# EAGLE schematic time-module (EAGLE 7.7.0)
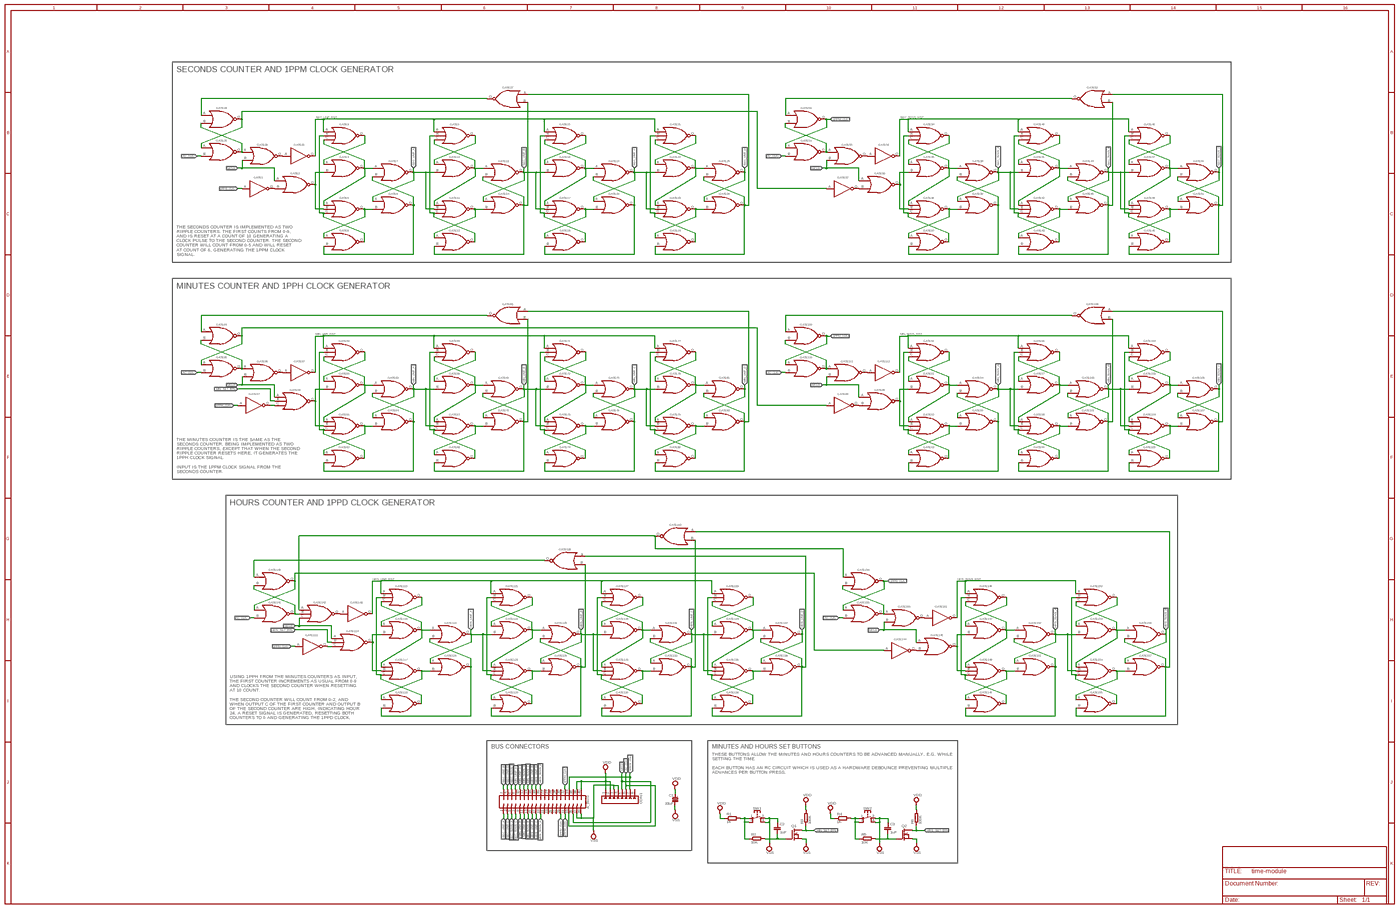
[diagram p0: schematic, sheet 1, overview]
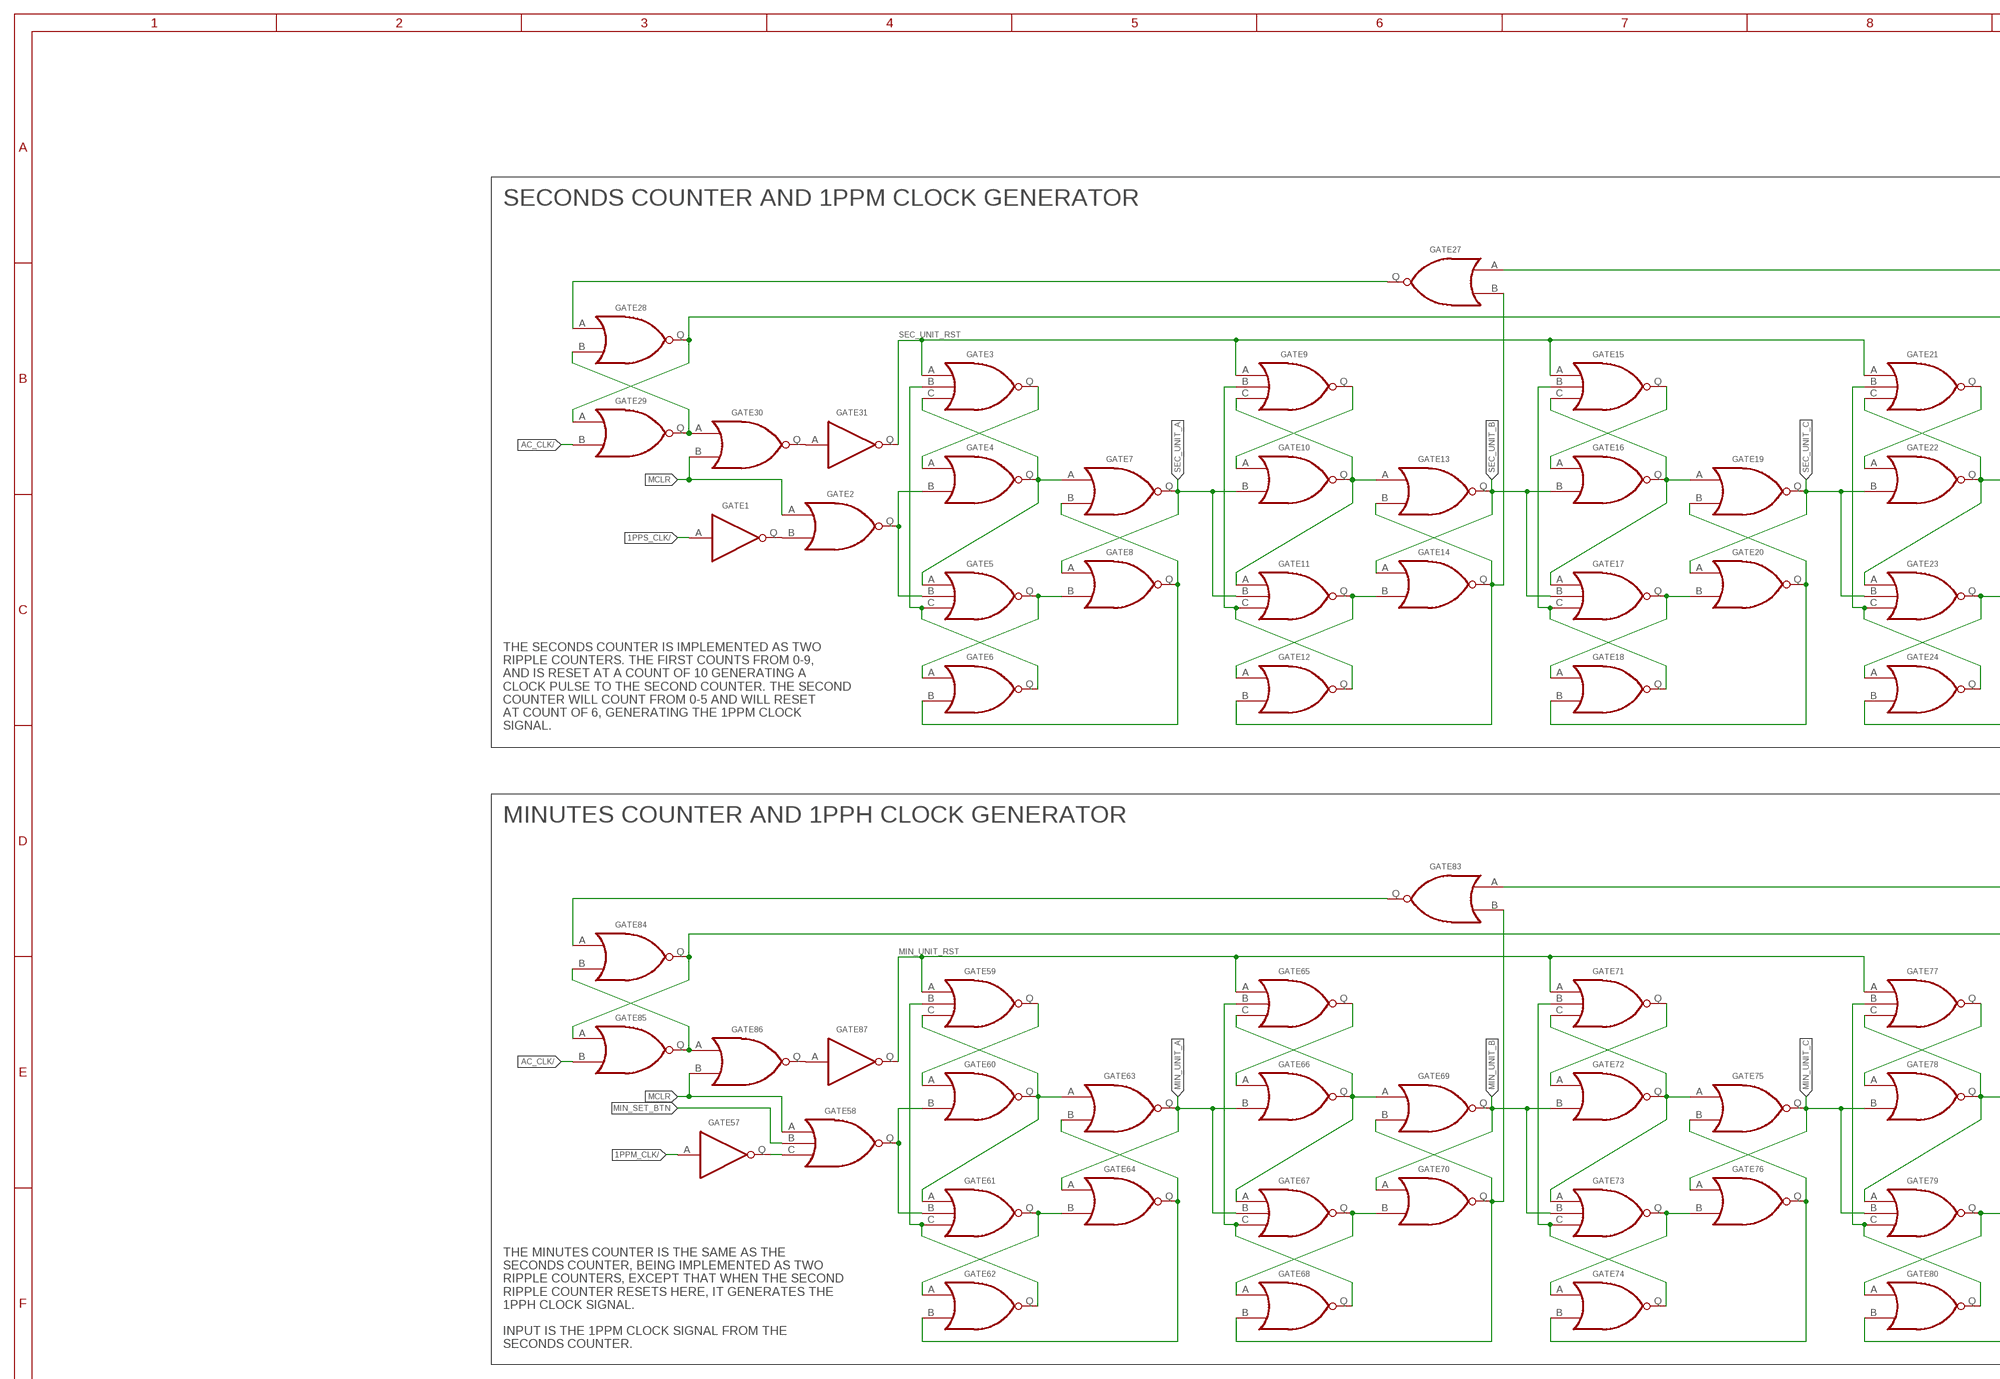
[diagram p1: schematic, sheet 1, part 1 of 4]
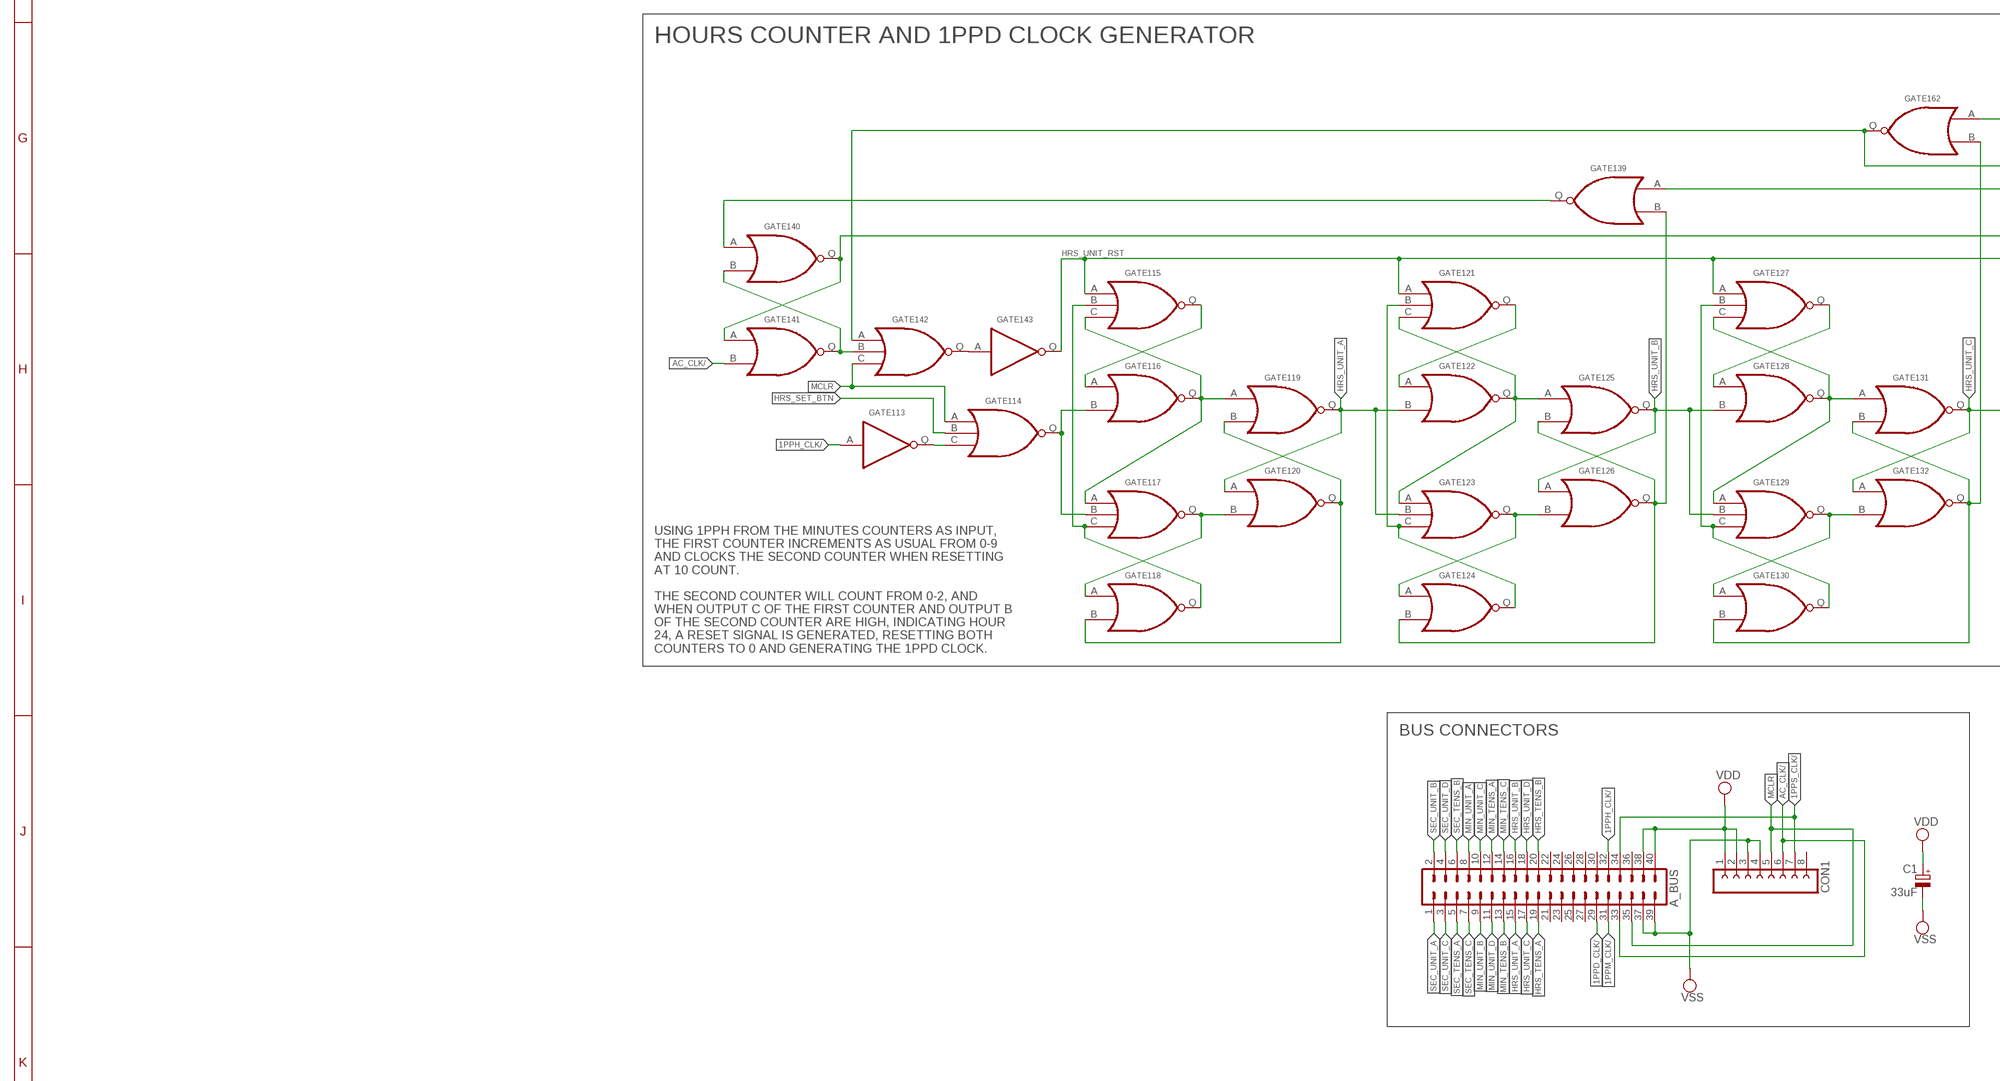
[diagram p2: schematic, sheet 1, part 2 of 4]
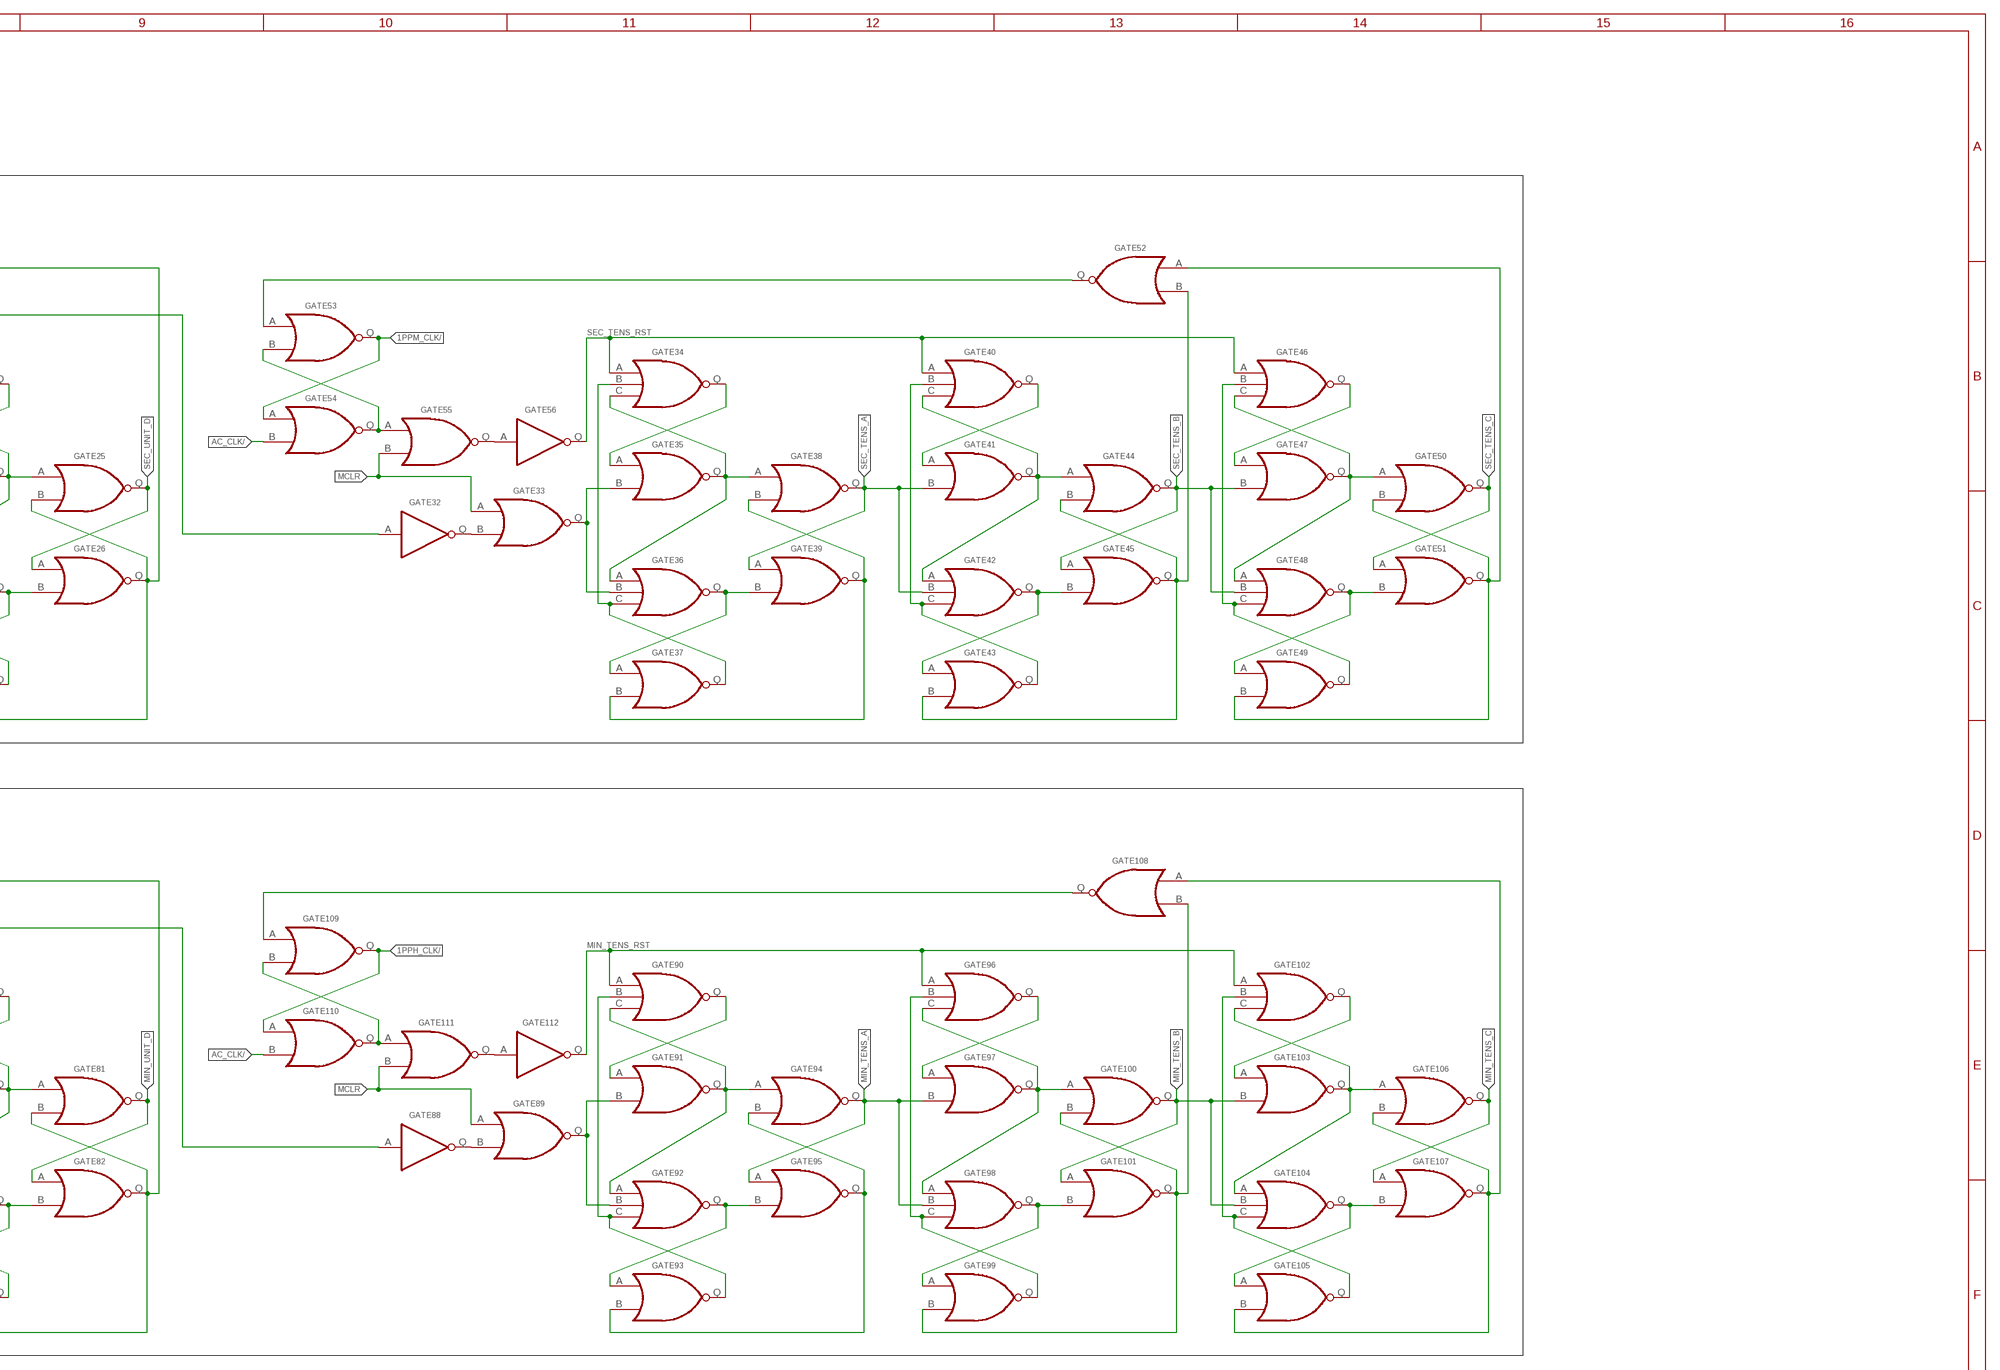
[diagram p3: schematic, sheet 1, part 3 of 4]
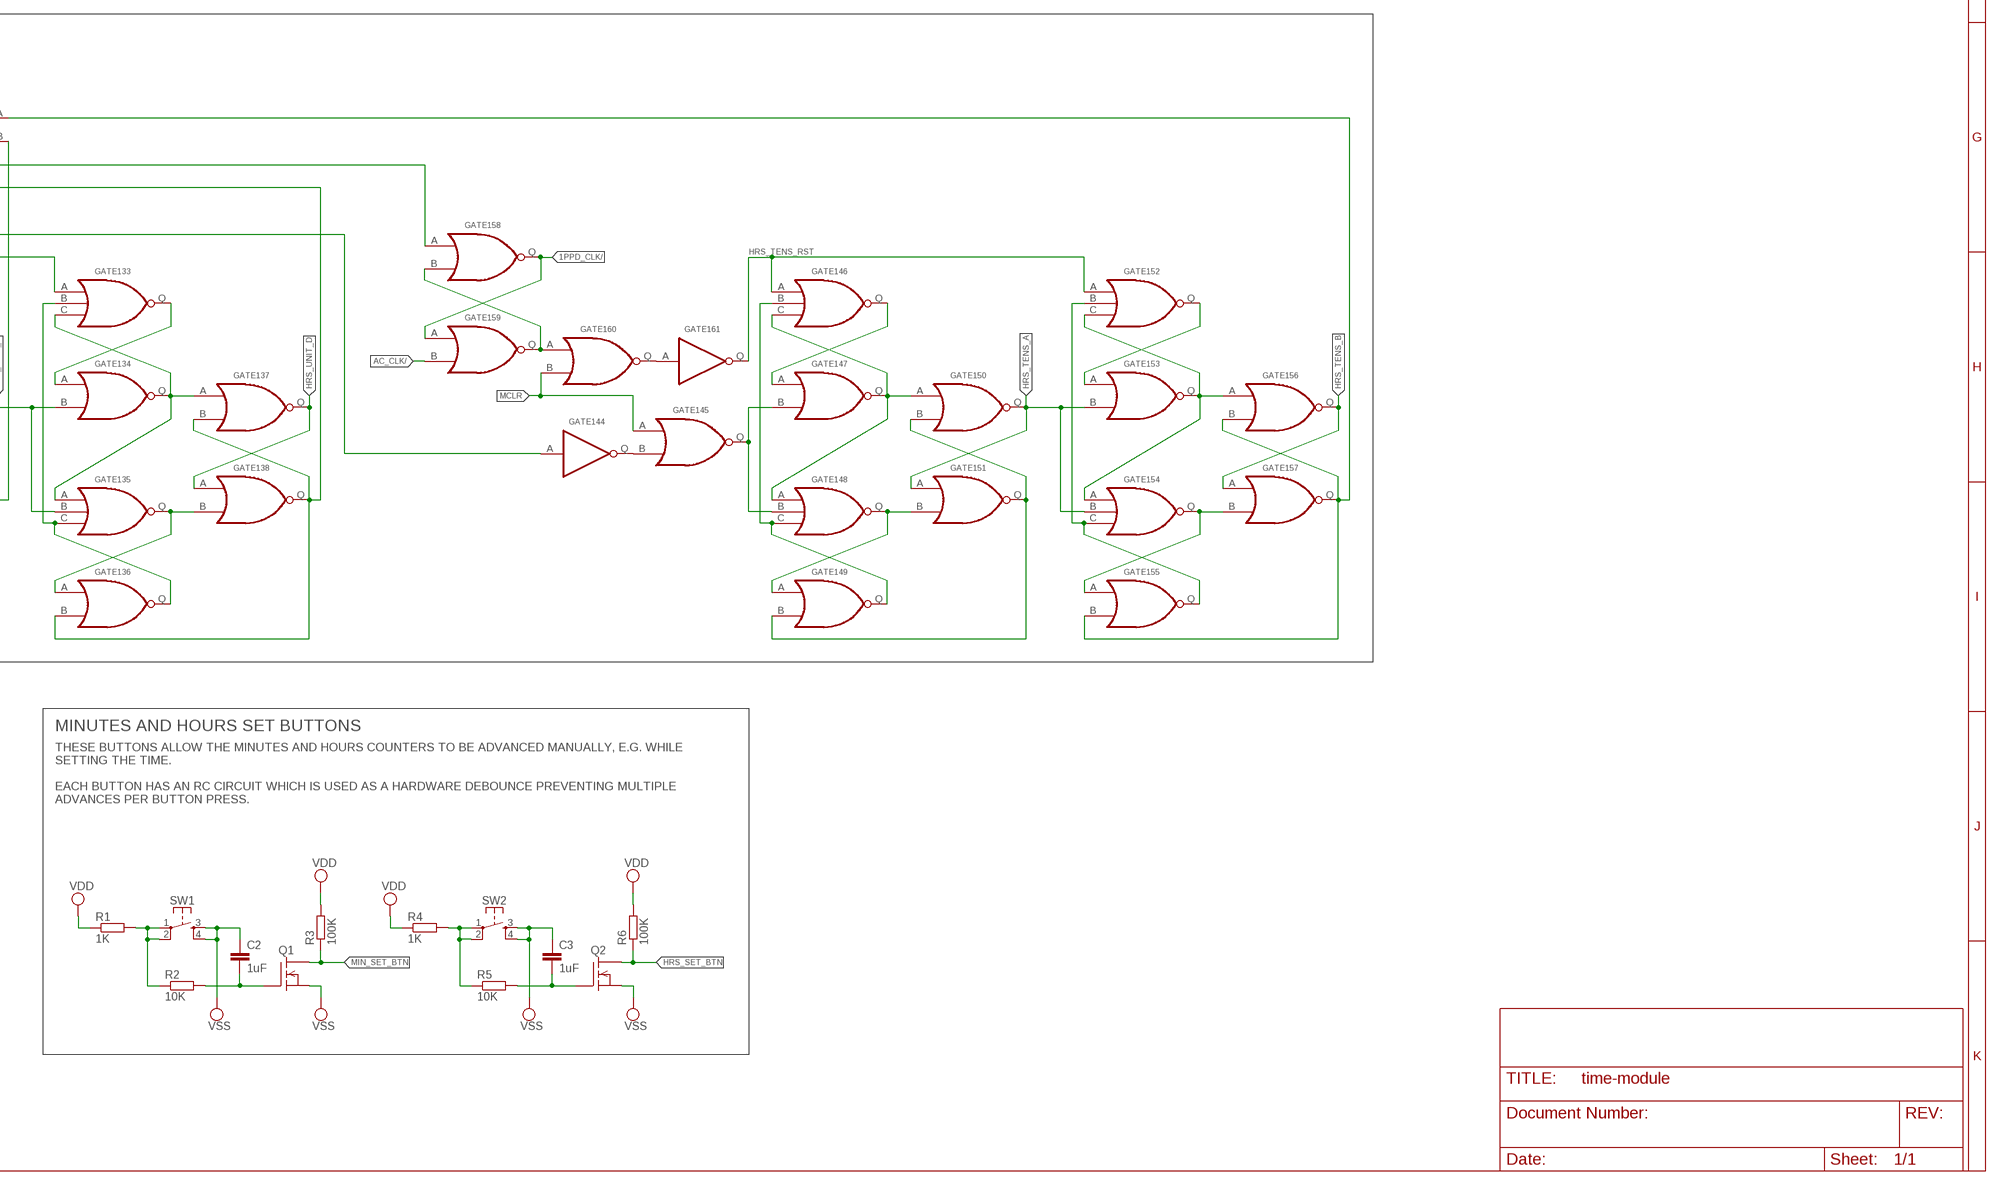
[diagram p4: schematic, sheet 1, part 4 of 4]

## Parts
A_BUS  MA20-2  [MA20-2]
C1  33uF  CPOL-EUE2.5-6  [E2,5-6]
C2  1uF  C-EU050-025X075  [C050-025X075]
C3  1uF  C-EU050-025X075  [C050-025X075]
CON1  FE08-1  [FE08]
GATE1  INVERTER  [INVERTER]
GATE2  2NOR  [2NOR]
GATE3  3NOR  [3NOR]
GATE4  2NOR  [2NOR]
GATE5  3NOR  [3NOR]
GATE6  2NOR  [2NOR]
GATE7  2NOR  [2NOR]
GATE8  2NOR  [2NOR]
GATE9  3NOR  [3NOR]
GATE10  2NOR  [2NOR]
GATE11  3NOR  [3NOR]
GATE12  2NOR  [2NOR]
GATE13  2NOR  [2NOR]
GATE14  2NOR  [2NOR]
GATE15  3NOR  [3NOR]
GATE16  2NOR  [2NOR]
GATE17  3NOR  [3NOR]
GATE18  2NOR  [2NOR]
GATE19  2NOR  [2NOR]
GATE20  2NOR  [2NOR]
GATE21  3NOR  [3NOR]
GATE22  2NOR  [2NOR]
GATE23  3NOR  [3NOR]
GATE24  2NOR  [2NOR]
GATE25  2NOR  [2NOR]
GATE26  2NOR  [2NOR]
GATE27  2NOR  [2NOR]
GATE28  2NOR  [2NOR]
GATE29  2NOR  [2NOR]
GATE30  2NOR  [2NOR]
GATE31  INVERTER  [INVERTER]
GATE32  INVERTER  [INVERTER]
GATE33  2NOR  [2NOR]
GATE34  3NOR  [3NOR]
GATE35  2NOR  [2NOR]
GATE36  3NOR  [3NOR]
GATE37  2NOR  [2NOR]
GATE38  2NOR  [2NOR]
GATE39  2NOR  [2NOR]
GATE40  3NOR  [3NOR]
GATE41  2NOR  [2NOR]
GATE42  3NOR  [3NOR]
GATE43  2NOR  [2NOR]
GATE44  2NOR  [2NOR]
GATE45  2NOR  [2NOR]
GATE46  3NOR  [3NOR]
GATE47  2NOR  [2NOR]
GATE48  3NOR  [3NOR]
GATE49  2NOR  [2NOR]
GATE50  2NOR  [2NOR]
GATE51  2NOR  [2NOR]
GATE52  2NOR  [2NOR]
GATE53  2NOR  [2NOR]
GATE54  2NOR  [2NOR]
GATE55  2NOR  [2NOR]
GATE56  INVERTER  [INVERTER]
GATE57  INVERTER  [INVERTER]
GATE58  3NOR  [3NOR]
GATE59  3NOR  [3NOR]
GATE60  2NOR  [2NOR]
GATE61  3NOR  [3NOR]
GATE62  2NOR  [2NOR]
GATE63  2NOR  [2NOR]
GATE64  2NOR  [2NOR]
GATE65  3NOR  [3NOR]
GATE66  2NOR  [2NOR]
GATE67  3NOR  [3NOR]
GATE68  2NOR  [2NOR]
GATE69  2NOR  [2NOR]
GATE70  2NOR  [2NOR]
GATE71  3NOR  [3NOR]
GATE72  2NOR  [2NOR]
GATE73  3NOR  [3NOR]
GATE74  2NOR  [2NOR]
GATE75  2NOR  [2NOR]
GATE76  2NOR  [2NOR]
GATE77  3NOR  [3NOR]
GATE78  2NOR  [2NOR]
GATE79  3NOR  [3NOR]
GATE80  2NOR  [2NOR]
GATE81  2NOR  [2NOR]
GATE82  2NOR  [2NOR]
GATE83  2NOR  [2NOR]
GATE84  2NOR  [2NOR]
GATE85  2NOR  [2NOR]
GATE86  2NOR  [2NOR]
GATE87  INVERTER  [INVERTER]
GATE88  INVERTER  [INVERTER]
GATE89  2NOR  [2NOR]
GATE90  3NOR  [3NOR]
GATE91  2NOR  [2NOR]
GATE92  3NOR  [3NOR]
GATE93  2NOR  [2NOR]
GATE94  2NOR  [2NOR]
GATE95  2NOR  [2NOR]
GATE96  3NOR  [3NOR]
GATE97  2NOR  [2NOR]
GATE98  3NOR  [3NOR]
GATE99  2NOR  [2NOR]
GATE100  2NOR  [2NOR]
GATE101  2NOR  [2NOR]
GATE102  3NOR  [3NOR]
GATE103  2NOR  [2NOR]
GATE104  3NOR  [3NOR]
GATE105  2NOR  [2NOR]
GATE106  2NOR  [2NOR]
GATE107  2NOR  [2NOR]
GATE108  2NOR  [2NOR]
GATE109  2NOR  [2NOR]
GATE110  2NOR  [2NOR]
GATE111  2NOR  [2NOR]
GATE112  INVERTER  [INVERTER]
GATE113  INVERTER  [INVERTER]
GATE114  3NOR  [3NOR]
GATE115  3NOR  [3NOR]
GATE116  2NOR  [2NOR]
GATE117  3NOR  [3NOR]
GATE118  2NOR  [2NOR]
GATE119  2NOR  [2NOR]
GATE120  2NOR  [2NOR]
GATE121  3NOR  [3NOR]
GATE122  2NOR  [2NOR]
GATE123  3NOR  [3NOR]
GATE124  2NOR  [2NOR]
GATE125  2NOR  [2NOR]
GATE126  2NOR  [2NOR]
GATE127  3NOR  [3NOR]
GATE128  2NOR  [2NOR]
GATE129  3NOR  [3NOR]
GATE130  2NOR  [2NOR]
GATE131  2NOR  [2NOR]
GATE132  2NOR  [2NOR]
GATE133  3NOR  [3NOR]
GATE134  2NOR  [2NOR]
GATE135  3NOR  [3NOR]
GATE136  2NOR  [2NOR]
GATE137  2NOR  [2NOR]
GATE138  2NOR  [2NOR]
GATE139  2NOR  [2NOR]
GATE140  2NOR  [2NOR]
GATE141  2NOR  [2NOR]
GATE142  3NOR  [3NOR]
GATE143  INVERTER  [INVERTER]
GATE144  INVERTER  [INVERTER]
GATE145  2NOR  [2NOR]
GATE146  3NOR  [3NOR]
GATE147  2NOR  [2NOR]
GATE148  3NOR  [3NOR]
GATE149  2NOR  [2NOR]
GATE150  2NOR  [2NOR]
GATE151  2NOR  [2NOR]
GATE152  3NOR  [3NOR]
GATE153  2NOR  [2NOR]
GATE154  3NOR  [3NOR]
GATE155  2NOR  [2NOR]
GATE156  2NOR  [2NOR]
GATE157  2NOR  [2NOR]
GATE158  2NOR  [2NOR]
GATE159  2NOR  [2NOR]
GATE160  2NOR  [2NOR]
GATE161  INVERTER  [INVERTER]
GATE162  2NOR  [2NOR]
Q1  2N7000  [TO-92]
Q2  2N7000  [TO-92]
R1  1K  R-EU_0207/2V  [0207/2V]
R2  10K  R-EU_0207/2V  [0207/2V]
R3  100K  R-EU_0207/2V  [0207/2V]
R4  1K  R-EU_0207/2V  [0207/2V]
R5  10K  R-EU_0207/2V  [0207/2V]
R6  100K  R-EU_0207/2V  [0207/2V]
SW1  SPST-TACSWITCH  [TE-SMD-TACSWITCH]
SW2  SPST-TACSWITCH  [TE-SMD-TACSWITCH]

## Nets
1PPD_CLK/: A_BUS.29 GATE158.Q GATE159.A
1PPH_CLK/: A_BUS.32 GATE109.Q GATE110.A GATE113.A
1PPM_CLK/: A_BUS.31 GATE53.Q GATE54.A GATE57.A
1PPS_CLK/: A_BUS.34 CON1.7 GATE1.A
AC_CLK/: A_BUS.33 CON1.6 GATE29.B GATE54.B GATE85.B GATE110.B GATE141.B GATE159.B
HRS_SET_BTN: GATE114.B Q2.3(D) R6.1
HRS_TENS_A: A_BUS.19 GATE150.Q GATE151.A GATE153.B GATE154.B
HRS_TENS_B: A_BUS.20 GATE156.Q GATE157.A
HRS_TENS_RST: GATE146.A GATE152.A GATE161.Q
HRS_UNIT_A: A_BUS.15 GATE119.Q GATE120.A GATE122.B GATE123.B
HRS_UNIT_B: A_BUS.16 GATE125.Q GATE126.A GATE128.B GATE129.B
HRS_UNIT_C: A_BUS.17 GATE131.Q GATE132.A GATE134.B GATE135.B
HRS_UNIT_D: A_BUS.18 GATE137.Q GATE138.A
HRS_UNIT_RST: GATE115.A GATE121.A GATE127.A GATE133.A GATE143.Q
HRS_UNIT_RST/: GATE140.Q GATE141.A GATE144.A
MCLR: A_BUS.35 CON1.5 GATE2.A GATE30.B GATE33.A GATE55.B GATE58.A GATE86.B GATE89.A GATE111.B GATE114.A GATE142.C GATE145.A GATE160.B
MIN_SET_BTN: GATE58.B Q1.3(D) R3.1
MIN_TENS_A: A_BUS.12 GATE94.Q GATE95.A GATE97.B GATE98.B
MIN_TENS_B: A_BUS.13 GATE100.Q GATE101.A GATE103.B GATE104.B
MIN_TENS_C: A_BUS.14 GATE106.Q GATE107.A
MIN_TENS_RST: GATE90.A GATE96.A GATE102.A GATE112.Q
MIN_UNIT_A: A_BUS.8 GATE63.Q GATE64.A GATE66.B GATE67.B
MIN_UNIT_B: A_BUS.9 GATE69.Q GATE70.A GATE72.B GATE73.B
MIN_UNIT_C: A_BUS.10 GATE75.Q GATE76.A GATE78.B GATE79.B
MIN_UNIT_D: A_BUS.11 GATE81.Q GATE82.A
MIN_UNIT_RST: GATE59.A GATE65.A GATE71.A GATE77.A GATE87.Q
MIN_UNIT_RST/: GATE84.Q GATE85.A GATE88.A
N$1: GATE34.C GATE35.Q GATE36.A GATE38.A
N$2: GATE34.Q GATE35.A
N$3: GATE34.B GATE36.C GATE37.Q
N$4: GATE36.Q GATE37.A GATE39.B
N$5: GATE37.B GATE38.B GATE39.Q
N$6: GATE59.C GATE60.Q GATE61.A GATE63.A
N$7: GATE40.C GATE41.Q GATE42.A GATE44.A
N$8: GATE40.Q GATE41.A
N$9: GATE40.B GATE42.C GATE43.Q
N$10: GATE42.Q GATE43.A GATE45.B
N$11: GATE43.B GATE44.B GATE45.Q GATE52.B
N$12: GATE3.C GATE4.Q GATE5.A GATE7.A
N$13: GATE59.Q GATE60.A
N$14: GATE46.C GATE47.Q GATE48.A GATE50.A
N$15: GATE46.Q GATE47.A
N$16: GATE3.Q GATE4.A
N$17: GATE46.B GATE48.C GATE49.Q
N$18: GATE3.B GATE5.C GATE6.Q
N$19: GATE48.Q GATE49.A GATE51.B
N$20: GATE49.B GATE50.B GATE51.Q GATE52.A
N$21: GATE59.B GATE61.C GATE62.Q
N$22: GATE52.Q GATE53.A
N$23: GATE5.Q GATE6.A GATE8.B
N$24: GATE32.Q GATE33.B
N$25: GATE53.B GATE54.Q GATE55.A
N$26: GATE61.Q GATE62.A GATE64.B
N$27: GATE62.B GATE63.B GATE64.Q
N$28: GATE65.C GATE66.Q GATE67.A GATE69.A
N$29: GATE65.Q GATE66.A
N$30: GATE6.B GATE7.B GATE8.Q
N$31: GATE65.B GATE67.C GATE68.Q
N$32: GATE67.Q GATE68.A GATE70.B
N$33: GATE68.B GATE69.B GATE70.Q GATE83.B
N$34: GATE71.C GATE72.Q GATE73.A GATE75.A
N$35: GATE9.C GATE10.Q GATE11.A GATE13.A
N$36: GATE71.Q GATE72.A
N$37: GATE9.Q GATE10.A
N$38: GATE9.B GATE11.C GATE12.Q
N$39: GATE71.B GATE73.C GATE74.Q
N$40: GATE73.Q GATE74.A GATE76.B
N$41: GATE74.B GATE75.B GATE76.Q
N$42: GATE11.Q GATE12.A GATE14.B
N$43: GATE77.C GATE78.Q GATE79.A GATE81.A
N$44: GATE77.Q GATE78.A
N$45: GATE77.B GATE79.C GATE80.Q
N$46: GATE12.B GATE13.B GATE14.Q GATE27.B
N$47: GATE15.C GATE16.Q GATE17.A GATE19.A
N$48: GATE79.Q GATE80.A GATE82.B
N$49: GATE15.Q GATE16.A
N$50: GATE15.B GATE17.C GATE18.Q
N$51: GATE17.Q GATE18.A GATE20.B
N$52: GATE18.B GATE19.B GATE20.Q
N$53: GATE21.C GATE22.Q GATE23.A GATE25.A
N$54: GATE21.Q GATE22.A
N$55: GATE21.B GATE23.C GATE24.Q
N$56: GATE23.Q GATE24.A GATE26.B
N$57: GATE24.B GATE25.B GATE26.Q GATE27.A
N$58: GATE27.Q GATE28.A
N$59: GATE30.Q GATE31.A
N$60: GATE28.B GATE29.Q GATE30.A
N$61: GATE80.B GATE81.B GATE82.Q GATE83.A
N$62: GATE83.Q GATE84.A
N$63: GATE55.Q GATE56.A
N$64: GATE158.B GATE159.Q GATE160.A
N$65: GATE90.C GATE91.Q GATE92.A GATE94.A
N$66: GATE90.Q GATE91.A
N$67: GATE90.B GATE92.C GATE93.Q
N$68: GATE92.Q GATE93.A GATE95.B
N$69: GATE93.B GATE94.B GATE95.Q
N$70: GATE96.C GATE97.Q GATE98.A GATE100.A
N$71: GATE96.Q GATE97.A
N$72: GATE96.B GATE98.C GATE99.Q
N$73: GATE98.Q GATE99.A GATE101.B
N$74: GATE99.B GATE100.B GATE101.Q GATE108.B
N$75: GATE102.C GATE103.Q GATE104.A GATE106.A
N$76: GATE102.Q GATE103.A
N$77: GATE102.B GATE104.C GATE105.Q
N$78: GATE104.Q GATE105.A GATE107.B
N$79: GATE105.B GATE106.B GATE107.Q GATE108.A
N$80: GATE108.Q GATE109.A
N$81: GATE88.Q GATE89.B
N$82: GATE84.B GATE85.Q GATE86.A
N$83: GATE115.C GATE116.Q GATE117.A GATE119.A
N$84: GATE115.Q GATE116.A
N$85: GATE115.B GATE117.C GATE118.Q
N$86: GATE117.Q GATE118.A GATE120.B
N$87: GATE118.B GATE119.B GATE120.Q
N$88: GATE121.C GATE122.Q GATE123.A GATE125.A
N$89: GATE121.Q GATE122.A
N$90: GATE121.B GATE123.C GATE124.Q
N$91: GATE123.Q GATE124.A GATE126.B
N$92: GATE124.B GATE125.B GATE126.Q GATE139.B
N$93: GATE127.C GATE128.Q GATE129.A GATE131.A
N$94: GATE127.Q GATE128.A
N$95: GATE127.B GATE129.C GATE130.Q
N$96: GATE129.Q GATE130.A GATE132.B
N$97: GATE130.B GATE131.B GATE132.Q GATE162.B
N$98: GATE133.C GATE134.Q GATE135.A GATE137.A
N$99: GATE133.Q GATE134.A
N$100: GATE133.B GATE135.C GATE136.Q
N$101: GATE135.Q GATE136.A GATE138.B
N$102: GATE136.B GATE137.B GATE138.Q GATE139.A
N$103: GATE139.Q GATE140.A
N$104: GATE140.B GATE141.Q GATE142.B
N$105: GATE113.Q GATE114.C
N$106: GATE142.A GATE158.A GATE162.Q
N$107: GATE109.B GATE110.Q GATE111.A
N$108: GATE146.C GATE147.Q GATE148.A GATE150.A
N$109: GATE146.Q GATE147.A
N$110: GATE146.B GATE148.C GATE149.Q
N$111: GATE148.Q GATE149.A GATE151.B
N$112: GATE149.B GATE150.B GATE151.Q
N$113: GATE152.C GATE153.Q GATE154.A GATE156.A
N$114: GATE152.Q GATE153.A
N$115: GATE152.B GATE154.C GATE155.Q
N$116: GATE154.Q GATE155.A GATE157.B
N$117: GATE142.Q GATE143.A
N$118: GATE2.Q GATE4.B GATE5.B
N$119: GATE1.Q GATE2.B
N$120: GATE155.B GATE156.B GATE157.Q GATE162.A
N$121: GATE33.Q GATE35.B GATE36.B
N$122: R1.2 R2.1 SW1.1 SW1.2
N$123: GATE58.Q GATE60.B GATE61.B
N$124: GATE86.Q GATE87.A
N$125: GATE89.Q GATE91.B GATE92.B
N$126: GATE111.Q GATE112.A
N$127: GATE114.Q GATE116.B GATE117.B
N$128: GATE144.Q GATE145.B
N$129: GATE145.Q GATE147.B GATE148.B
N$130: GATE160.Q GATE161.A
N$131: GATE57.Q GATE58.C
N$133: C2.2 Q1.2(G) R2.2
N$134: R4.2 R5.1 SW2.1 SW2.2
N$135: C3.2 Q2.2(G) R5.2
SEC_TENS_A: A_BUS.5 GATE38.Q GATE39.A GATE41.B GATE42.B
SEC_TENS_B: A_BUS.6 GATE44.Q GATE45.A GATE47.B GATE48.B
SEC_TENS_C: A_BUS.7 GATE50.Q GATE51.A
SEC_TENS_RST: GATE34.A GATE40.A GATE46.A GATE56.Q
SEC_UNIT_A: A_BUS.1 GATE7.Q GATE8.A GATE10.B GATE11.B
SEC_UNIT_B: A_BUS.2 GATE13.Q GATE14.A GATE16.B GATE17.B
SEC_UNIT_C: A_BUS.3 GATE19.Q GATE20.A GATE22.B GATE23.B
SEC_UNIT_D: A_BUS.4 GATE25.Q GATE26.A
SEC_UNIT_RST: GATE3.A GATE9.A GATE15.A GATE21.A GATE31.Q
SEC_UNIT_RST/: GATE28.Q GATE29.A GATE32.A
VDD: A_BUS.38 A_BUS.40 C1.+ CON1.1 CON1.2 R1.1 R3.2 R4.1 R6.2
VSS: A_BUS.37 A_BUS.39 C1.- C2.1 C3.1 CON1.3 CON1.4 Q1.1(S) Q2.1(S) SW1.3 SW1.4 SW2.3 SW2.4
Unconnected: A_BUS.21 A_BUS.22 A_BUS.23 A_BUS.24 A_BUS.25 A_BUS.26 A_BUS.27 A_BUS.28 A_BUS.30 A_BUS.36 CON1.8

## Notes on the sheet
- SECONDS COUNTER AND 1PPM CLOCK GENERATOR
- THE SECONDS COUNTER IS IMPLEMENTED AS TWO
  RIPPLE COUNTERS. THE FIRST COUNTS FROM 0-9,
  AND IS RESET AT A COUNT OF 10 GENERATING A
  CLOCK PULSE TO THE SECOND COUNTER. THE SECOND
  COUNTER WILL COUNT FROM 0-5 AND WILL RESET
  AT COUNT OF 6, GENERATING THE 1PPM CLOCK
  SIGNAL.
- MINUTES COUNTER AND 1PPH CLOCK GENERATOR
- THE MINUTES COUNTER IS THE SAME AS THE
  SECONDS COUNTER, BEING IMPLEMENTED AS TWO
  RIPPLE COUNTERS, EXCEPT THAT WHEN THE SECOND
  RIPPLE COUNTER RESETS HERE, IT GENERATES THE
  1PPH CLOCK SIGNAL.
  
  INPUT IS THE 1PPM CLOCK SIGNAL FROM THE
  SECONDS COUNTER.
- HOURS COUNTER AND 1PPD CLOCK GENERATOR
- USING 1PPH FROM THE MINUTES COUNTERS AS INPUT,
  THE FIRST COUNTER INCREMENTS AS USUAL FROM 0-9
  AND CLOCKS THE SECOND COUNTER WHEN RESETTING
  AT 10 COUNT.
  
  THE SECOND COUNTER WILL COUNT FROM 0-2, AND
  WHEN OUTPUT C OF THE FIRST COUNTER AND OUTPUT B
  OF THE SECOND COUNTER ARE HIGH, INDICATING HOUR
  24, A RESET SIGNAL IS GENERATED, RESETTING BOTH
  COUNTERS TO 0 AND GENERATING THE 1PPD CLOCK.
- BUS CONNECTORS | MINUTES AND HOURS SET BUTTONS
- THESE BUTTONS ALLOW THE MINUTES AND HOURS COUNTERS TO BE ADVANCED MANUALLY, E.G. WHILE
  SETTING THE TIME.
  
  EACH BUTTON HAS AN RC CIRCUIT WHICH IS USED AS A HARDWARE DEBOUNCE PREVENTING MULTIPLE
  ADVANCES PER BUTTON PRESS.

## Library data of the parts
A_BUS = con-lstb:MA20-2: PIN HEADER; OC_FARNELL: unknown; OC_NEWARK: unknown
C1 = rcl:CPOL-EU: POLARIZED CAPACITOR, European symbol
C2 C3 = rcl:C-EU: CAPACITOR, European symbol
CON1 = con-lsta:FE08-1: FEMALE HEADER; OC_FARNELL: unknown; OC_NEWARK: unknown
GATE1 GATE31 GATE32 GATE56 GATE57 GATE87 GATE88 GATE112 GATE113 GATE143 GATE144 GATE161 = NOR gate clock:INVERTER
GATE2 GATE4 GATE6-GATE8 GATE10 GATE12-GATE14 GATE16 GATE18-GATE20 GATE22 GATE24-GATE30 GATE33 GATE35 GATE37-GATE39 GATE41 GATE43-GATE45 GATE47 GATE49-GATE55 GATE60 GATE62-GATE64 GATE66 GATE68-GATE70 GATE72 GATE74-GATE76 GATE78 GATE80-GATE86 GATE89 GATE91 GATE93-GATE95 GATE97 GATE99-GATE101 GATE103 GATE105-GATE111 GATE116 GATE118-GATE120 GATE122 GATE124-GATE126 GATE128 GATE130-GATE132 GATE134 GATE136-GATE141 GATE145 GATE147 GATE149-GATE151 GATE153 GATE155-GATE160 GATE162 = NOR gate clock:2NOR
GATE3 GATE5 GATE9 GATE11 GATE15 GATE17 GATE21 GATE23 GATE34 GATE36 GATE40 GATE42 GATE46 GATE48 GATE58 GATE59 GATE61 GATE65 GATE67 GATE71 GATE73 GATE77 GATE79 GATE90 GATE92 GATE96 GATE98 GATE102 GATE104 GATE114 GATE115 GATE117 GATE121 GATE123 GATE127 GATE129 GATE133 GATE135 GATE142 GATE146 GATE148 GATE152 GATE154 = NOR gate clock:3NOR
Q1 Q2 = NOR gate clock:2N7000: N channel MOSFET
R1-R6 = NOR gate clock:R-EU_
SW1 SW2 = Toms Library:SPST-TACSWITCH: TE SPST normally-open tactile switch. MPN: 4-1437565-1 Rating: 0.05A @ 12V